# Altium schematic sheet Solar_950_test.SchDoc
size A1; SPICEModelCacheYQEDCYZF: <root> / <DocumentId>YQEDCYZF</DocumentId> / </root>
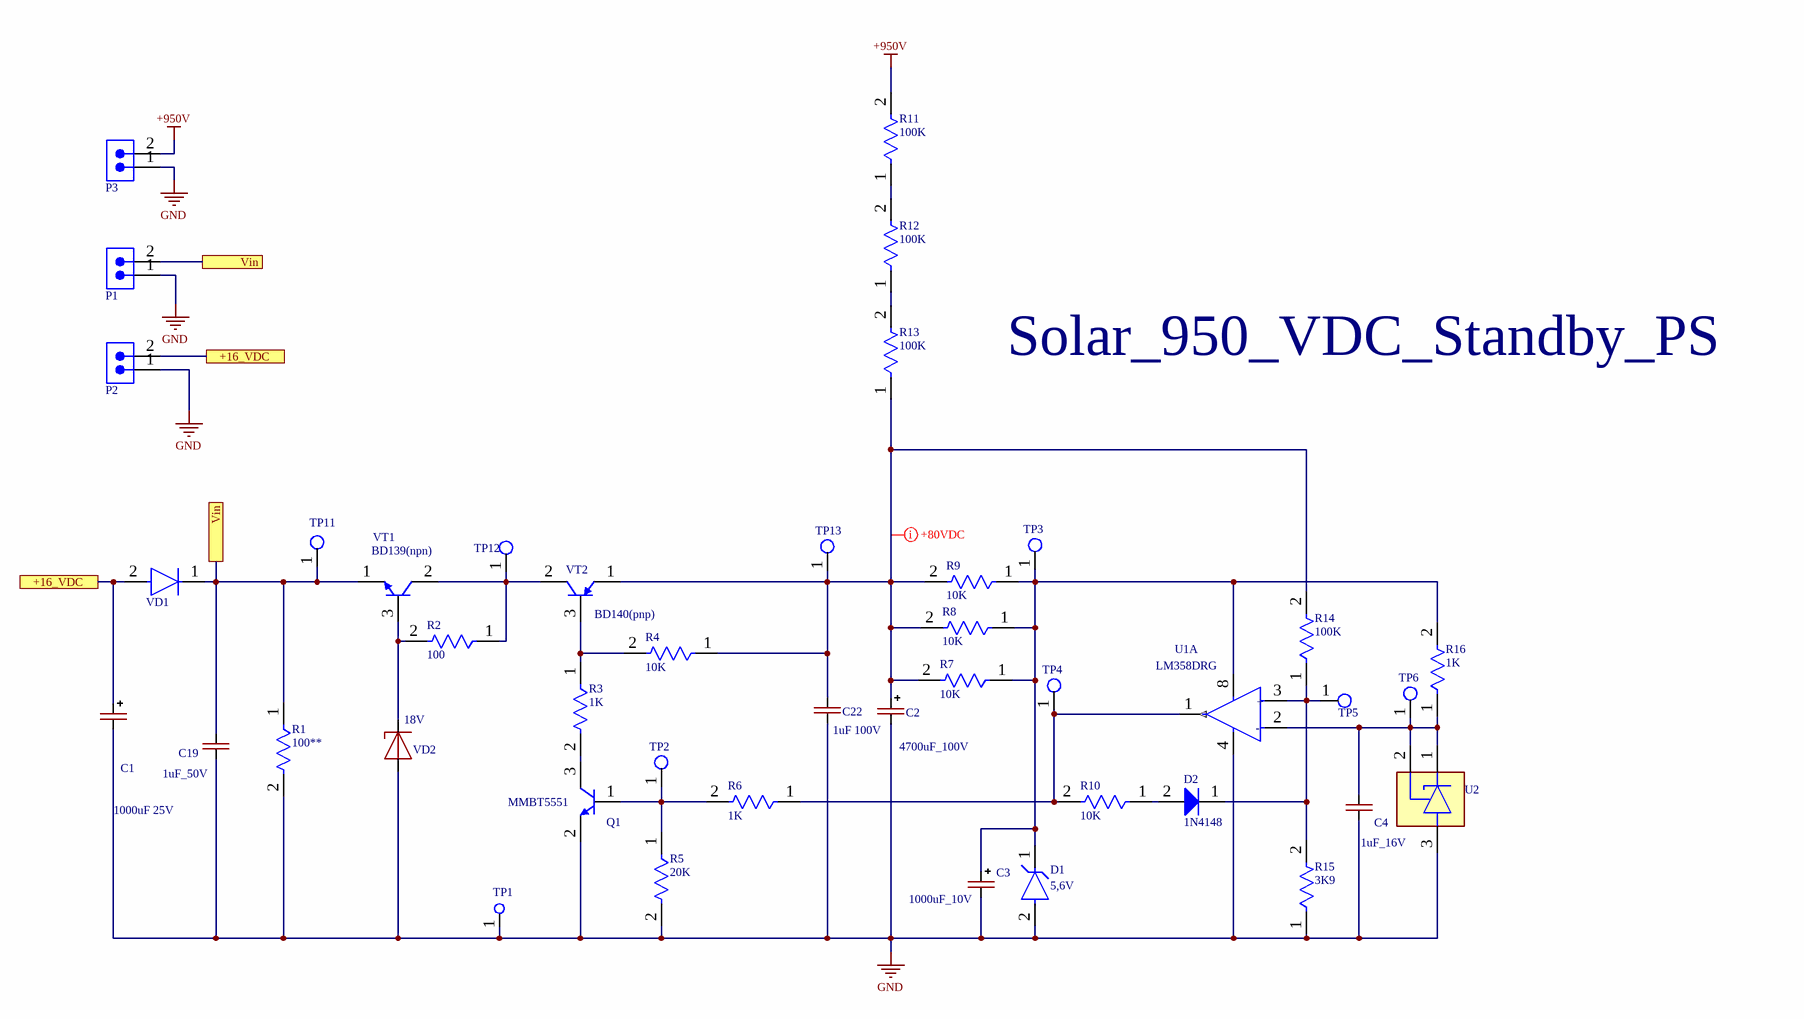
[diagram p0: Solar_950_test.SchDoc]

## Parts
C1  1000uF 25V  [CAPPOL-12x25]
C2  4700uF_100V  [CAPPOL_35x60]
C3  1000uF_10V  [CAP_SMD_Size_E]
C4  1uF_16V  [CAP-0805]
C19  1uF_50V  [CAP-0805]
C22  1uF 100V  [CAP-0805]
D1  5,6V  [FP-SB-V-3906_04-031_4-MFG]
D2  1N4148  [DIOD-SOD123-2_V]
P1  691701530002B  [691701530002B]  (value not drawn)
P2  691701530002B  [691701530002B]  (value not drawn)
P3  691701530002B  [691701530002B]  (value not drawn)
Q1  MMBT5551  [INF-SOT23_N]
R1  100**  [RES-2512]
R2  100  [RES-2512]
R3  1K  [RES-2512]
R4  10K  [RES-0805]
R5  20K  [RES-0805]
R6  1K  [RES-0805]
R7  10K  [RES-2512]
R8  10K  [RES-2512]
R9  10K  [RES-2512]
R10  10K  [RES-0805]
R11  100K  [RES-2512]
R12  100K  [RES-2512]
R13  100K  [RES-2512]
R14  100K  [RES-0805]
R15  3K9  [RES-0805]
R16  1K  [RES-0805]
TP1  Test_Point_PCB  [Pin_Test_Point(Pink)]  (value not drawn)
TP2  Test_Point_PCB  [Test_Point]  (value not drawn)
TP3  Test_Point_PCB  [Test_Point]  (value not drawn)
TP4  Test_Point_PCB  [Test_Point]  (value not drawn)
TP5  Test_Point_PCB  [Test_Point]  (value not drawn)
TP6  Test_Point_PCB  [Test_Point]  (value not drawn)
TP11  (no value)  [Test_Point]
TP12  Test_Point_PCB  [Test_Point]  (value not drawn)
TP13  Test_Point_PCB  [Test_Point]  (value not drawn)
U1  LM358DRG  [SO8-150]  (part A of 2)
U2  (no value)  [TL431_SOT-23-3(A)]
VD1  US1G  [US1G_SMA]  (value not drawn)
VD2  18V  [DO-201]
VT1  BD139(npn)  [TO-126(bend2)]
VT2  BD140(pnp)  [TO-126]

## Ports
+16_VDC, Vin

## Nets
+950V: P3.2 R11.2
GND: C1.2(-) C2.2(-) C3.2(-) C4.1 C19.2 C22.1 D1.2(A) P1.1 P2.1 P3.1 Q1.2(E) R1.2 R5.2 R15.1 TP1.1(G9) U1.4(VEE/GND) U2.3(A) VD2.2(A)
+16_VDC: C1.1(+) P2.2 VD1.2(A) ; port +16_VDC
Vin: C19.1 P1.2 R1.1 TP11.1(G9) VD1.1(C) VT1.1(E) ; port Vin
NetC2_1: C2.1(+) C22.2 R4.1 R7.2 R8.2 R9.2 R13.1 R14.2 TP13.1(G9) VT2.1(E)
NetC3_1: C3.1(+) D1.1(C) R7.1 R8.1 R9.1 R16.2 TP3.1(G9) U1.8(VCC)
NetC4_2: C4.2 R16.1 TP6.1(G9) U1.2(INPUT_A-) U2.1(C) U2.2(REF)
NetD2_1: D2.1(K) R14.1 R15.2 TP5.1(G9) U1.3(INPUT_A+)
NetD2_2: D2.2(A) R10.1
NetQ1_1: Q1.1(B) R5.1 R6.2 TP2.1(G9)
NetQ1_3: Q1.3(C) R3.2
NetR2_1: R2.1 TP12.1(G9) VT1.2(C) VT2.2(C)
NetR2_2: R2.2 VD2.1(C) VT1.3(B)
NetR3_1: R3.1 R4.2 VT2.3(B)
NetR6_1: R6.1 R10.2 TP4.1(G9) U1.1(OUTPUT_A)
NetR11_1: R11.1 R12.2
NetR12_1: R12.1 R13.2

## Layout directives
mark named +80VDC: NetC2_1

## Notes on the sheet
- Solar_950_VDC_Standby_PS
- (in symbol LM358DRG, part A) +; -

## Library data of the parts
C1 C2 = CAP-POLAR
C3 = CAP_POL_SMD
C4 C19 C22 = CAP-NON-POLAR
D1 = CMP-02541-000026-1: DIODE ZENER 8.2V 500MW DO35; Test Current: 5mA; Tolerance: 2%; Impedance: 7R; ESD Protection: No; Element Configuration: Single; Max Reverse Leakage Current: 100nA; Packaging: Ammo Pack; Case/Package: DO-35; Lead Free: Lead Free; Number of Pins: 2; Min Operating Temperature: -65°C; Contact Plating: Tin; Max Power Dissipation: 500mW; Radiation Hardening: No; Max Operating Temperature: 175°C; Mount: Through Hole; Package Quantity: 30000; Voltage Tolerance: 2%; Series: Automotive, AEC-Q101; Zener Voltage: 8.2V; RoHS Compliant: Yes; Power Dissipation: 500mW
P1-P3 = 691701530002B: WR-TBL Series 7015B Open Horizontal PCB Header, SMT, pitch 5.08mm, 2p; Manufacturer: Wurth Elektronik; Modularity: No; Rated Current: 10A; Working Voltage: 300V; ComponentLink1Description: Website Link; ComponentLink1URL: https://www.we-online.com/redexpert/article/691701530002B?ad; ComponentLink2Description: Datasheet Link; ComponentLink2URL: https://www.we-online.com/redexpert/spec/691701530002B?ad; Manufacturer Part Number: 691701530002B; Category: Terminal Blocks; Match Code: WR-TBL; Mount: Surface Mount; Operating Temperature Max: 105°C; Operating Temperature Min: -40°C; Packaging: Box; Application: Pluggable; Number of Pins: 2; Number of Rows: 1; Orientation: Horizontal; Pitch: 5.08mm
Q1 = BC847C_Infineon: NPN Silicon AF Transistor, 45 V VCEO, 100 mA IC, SOT23, Reel, Green; PartNumber: BC847C; Ptot (max): 330Â mW; VEBO (max): 6Â V; IBM (max): 200Â mA; VCBO (max): 50Â V; Green: TRUE; fT (typ): 250Â MHz; VCEO (max): 45Â V; IC (max): 100Â mA; ICBO (max): 15Â nA; Polarity: NPN; PackageVersion: Apr-08; ComponentLink1Description: Manufacturer URL; ComponentLink2Description: Datasheet; ComponentLink3URL: http://www.infineon.com/dgdl/SOT23-Package_Overview.pdf?folderId=db3a30431936bc4b0119532290053c66&fileId=db3a30431936bc4b0119533468123c85; ComponentLink3Description: Package Specification; ComponentLink1URL: http://www.infineon.com/; Packing: Reel; ComponentLink2URL: http://www.infineon.com/dgdl/bc847series_bc848series_bc849series_bc850series.pdf?folderId=db3a304314dca389011541d30fa21656&fileId=db3a304314dca389011541d4630a1657; Manufacturer: Infineon; ICM (max): 200Â mA; Mounting Technology: Surface Mount; PackageReference: SOT23; PackageDescription: 3-Pin Small Outline Transistor Package, 1.3 x 2.9 mm Body, 0.95 mm Pitch
R1 = RES-CONST: 100
R2-R16 = RES-CONST
TP1-TP6 TP11-TP13 = TP_PCB?: Test_Point
U2 = TL431_SOT-23-3
VD2 = ZENER
VT1 = BD139
VT2 = BD140